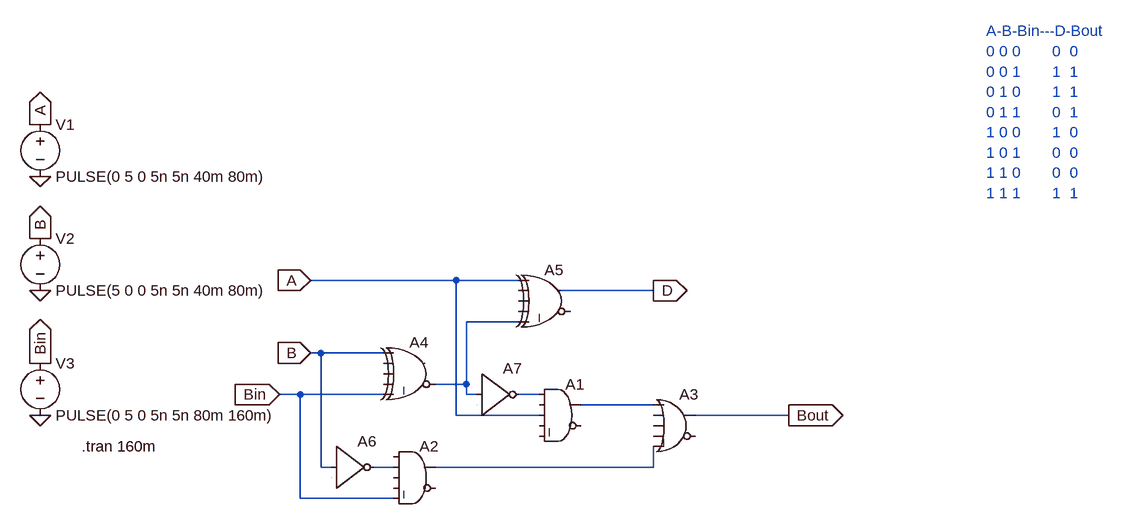
[diagram p0: schematic Full Subtrctor.asc]
Full Subtrctor.asc, the LTspice schematic file:
Version 4
SHEET 1 1244 804
WIRE 224 0 0 0
WIRE 320 0 224 0
WIRE 528 16 384 16
WIRE 320 64 240 64
WIRE 16 112 0 112
WIRE 112 112 16 112
WIRE 240 160 240 64
WIRE 240 160 192 160
WIRE -16 176 -48 176
WIRE 112 176 -16 176
WIRE 240 176 240 160
WIRE 256 176 240 176
WIRE 352 176 320 176
WIRE 528 192 416 192
WIRE 224 208 224 0
WIRE 352 208 224 208
WIRE 736 208 592 208
WIRE 16 288 16 112
WIRE 32 288 16 288
WIRE 128 288 96 288
WIRE 528 288 528 256
WIRE 528 288 192 288
WIRE -16 336 -16 176
WIRE 128 336 -16 336
FLAG 0 0 A
IOPIN 0 0 In
FLAG 0 112 B
IOPIN 0 112 In
FLAG -48 176 Bin
IOPIN -48 176 In
FLAG 736 208 Bout
IOPIN 736 208 Out
FLAG -416 -160 0
FLAG -416 16 0
FLAG -416 208 0
FLAG -416 -240 A
IOPIN -416 -240 Out
FLAG -416 -64 B
IOPIN -416 -64 Out
FLAG -416 128 Bin
IOPIN -416 128 Out
FLAG 528 16 D
IOPIN 528 16 Out
SYMBOL Digital\\and 384 144 R0
SYMATTR InstName A1
SYMBOL Digital\\and 160 240 R0
SYMATTR InstName A2
SYMBOL Digital\\or 560 160 R0
SYMATTR InstName A3
SYMBOL Digital\\xor 160 80 R0
SYMATTR InstName A4
SYMBOL Digital\\xor 368 -32 R0
SYMATTR InstName A5
SYMBOL Digital\\inv 32 224 R0
SYMATTR InstName A6
SYMBOL Digital\\inv 256 112 R0
SYMATTR InstName A7
SYMBOL voltage -416 -256 R0
WINDOW 123 0 0 Left 0
WINDOW 39 0 0 Left 0
SYMATTR InstName V1
SYMATTR Value PULSE(0 5 0 5n 5n 40m 80m)
SYMBOL voltage -416 -80 R0
WINDOW 123 0 0 Left 0
WINDOW 39 0 0 Left 0
SYMATTR InstName V2
SYMATTR Value PULSE(5 0 0 5n 5n 40m 80m)
SYMBOL voltage -416 112 R0
WINDOW 123 0 0 Left 0
WINDOW 39 0 0 Left 0
SYMATTR InstName V3
SYMATTR Value PULSE(0 5 0 5n 5n 80m 160m)
TEXT -352 256 Left 2 !.tran 160m
TEXT 1040 -384 Left 2 ;A-B-Bin---D-Bout\n0 0 0       0  0\n0 0 1       1  1\n0 1 0       1  1\n0 1 1       0  1\n1 0 0       1  0\n1 0 1       0  0\n1 1 0       0  0 \n1 1 1       1  1

The netlist it stands for:
* Full Subtrctor.asc
A1 N002 0 A 0 0 0 N003 0 AND
A2 0 N004 0 0 Bin 0 N005 0 AND
A3 N003 0 0 0 N005 0 Bout 0 OR
A4 B 0 0 0 Bin N001 0 0 XOR
A5 A 0 0 0 N001 0 D 0 XOR
A6 B 0 0 0 0 N004 0 0 BUF
A7 N001 0 0 0 0 N002 0 0 BUF
V1 A 0 PULSE(0 5 0 5n 5n 40m 80m)
V2 B 0 PULSE(5 0 0 5n 5n 40m 80m)
V3 Bin 0 PULSE(0 5 0 5n 5n 80m 160m)
.tran 160m
* A-B-Bin---D-Bout
* 0 0 0       0  0
* 0 0 1       1  1
* 0 1 0       1  1
* 0 1 1       0  1
* 1 0 0       1  0
* 1 0 1       0  0
* 1 1 0       0  0
* 1 1 1       1  1
.backanno
.end